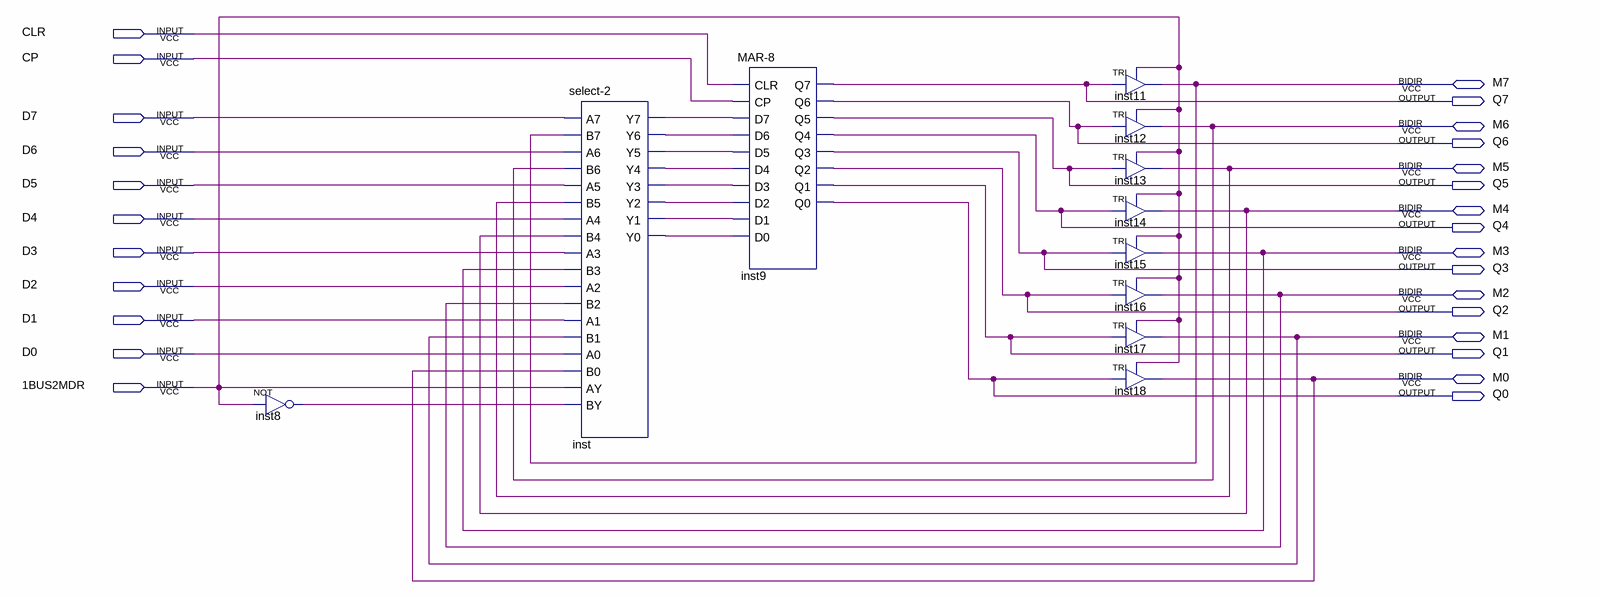
[diagram p0: schematic sheet]
// Quartus schematic MDR.bdf as structural Verilog: 11 symbols, 27 pins
module MDR (
  input  CLR,
  input  CP,
  input  D7,
  input  D6,
  input  D5,
  input  D4,
  input  D3,
  input  D2,
  input  D1,
  input  D0,
  input  \1BUS2MDR ,
  inout  M7,
  inout  M6,
  inout  M5,
  inout  M4,
  inout  M3,
  inout  M2,
  inout  M1,
  inout  M0,
  output Q7,
  output Q6,
  output Q5,
  output Q4,
  output Q3,
  output Q2,
  output Q1,
  output Q0
);

  wire inst8_out, inst_y0, inst_y1, inst_y2, inst_y3, inst_y4, inst_y5, inst_y6, inst_y7;

  not inst8 (inst8_out, \1BUS2MDR );
  \select-2  inst (
    .A7(D7), .B7(M7), .A6(D6), .B6(M6), .A5(D5), .B5(M5), .A4(D4), .B4(M4), .A3(D3), .B3(M3), .A2(D2),
    .B2(M2), .A1(D1), .B1(M1), .A0(D0), .B0(M0), .AY(\1BUS2MDR ), .BY(inst8_out), .Y7(inst_y7), .Y6(inst_y6),
    .Y5(inst_y5), .Y4(inst_y4), .Y3(inst_y3), .Y2(inst_y2), .Y1(inst_y1), .Y0(inst_y0));
  \MAR-8  inst9 (
    .CLR(CLR), .CP(CP), .D7(inst_y7), .D6(inst_y6), .D5(inst_y5), .D4(inst_y4), .D3(inst_y3), .D2(inst_y2),
    .D1(inst_y1), .D0(inst_y0), .Q7(Q7), .Q6(Q6), .Q5(Q5), .Q4(Q4), .Q3(Q3), .Q2(Q2), .Q1(Q1), .Q0(Q0));
  TRI inst11 (.IN(Q7), .OE(\1BUS2MDR ), .OUT(M7));
  TRI inst12 (.IN(Q6), .OE(\1BUS2MDR ), .OUT(M6));
  TRI inst13 (.IN(Q5), .OE(\1BUS2MDR ), .OUT(M5));
  TRI inst14 (.IN(Q4), .OE(\1BUS2MDR ), .OUT(M4));
  TRI inst15 (.IN(Q3), .OE(\1BUS2MDR ), .OUT(M3));
  TRI inst16 (.IN(Q2), .OE(\1BUS2MDR ), .OUT(M2));
  TRI inst17 (.IN(Q1), .OE(\1BUS2MDR ), .OUT(M1));
  TRI inst18 (.IN(Q0), .OE(\1BUS2MDR ), .OUT(M0));
endmodule
